# EAGLE design tedy (EAGLE 8.5.1)
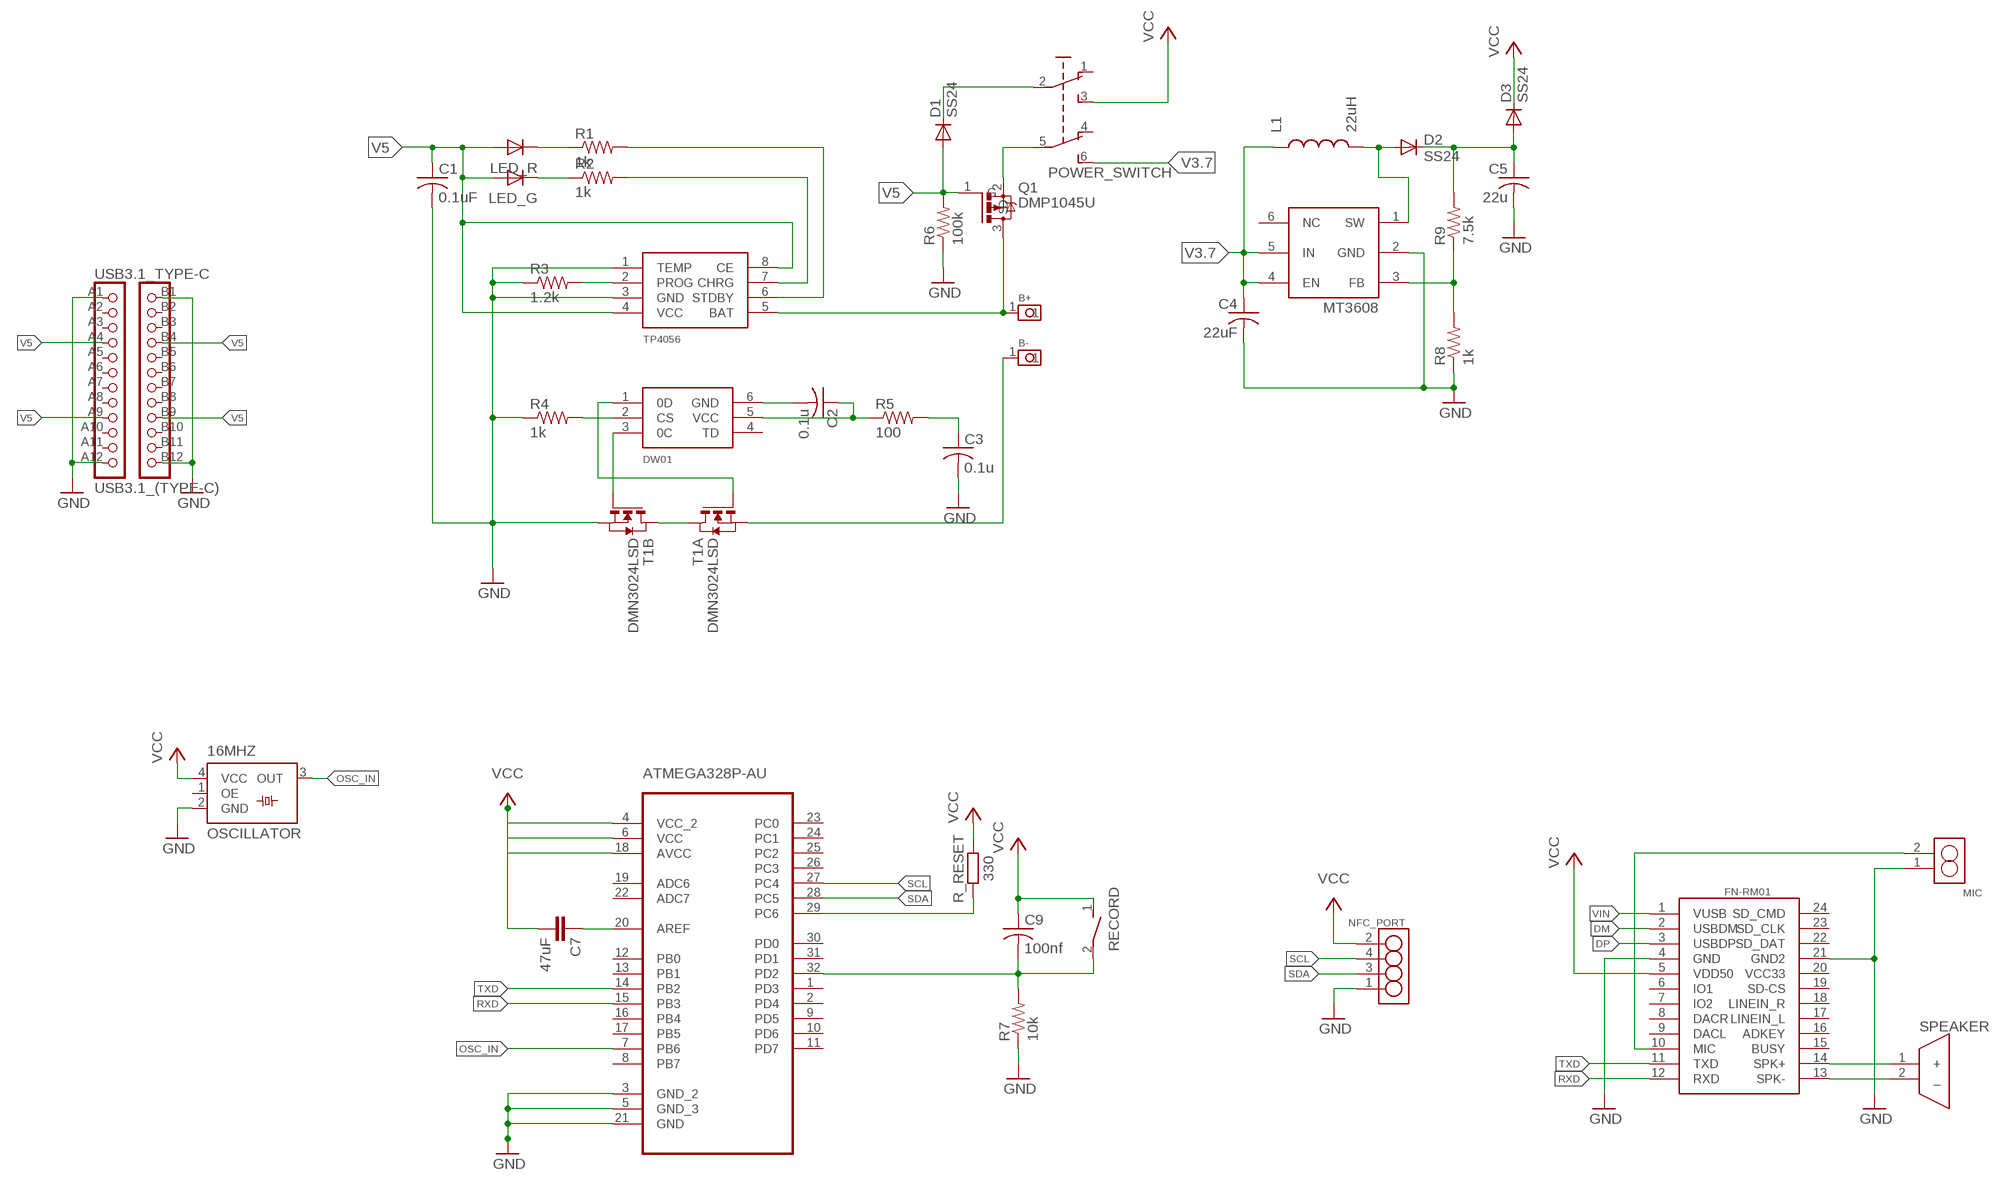
[diagram p0: schematic, sheet 1]

## Parts
16MHZ  OSCILLATOR  [OSCILLATOR_(3.2*2.5)]
ATMEGA328P-AU  ATMEGA328P-AU  [QFP80P900X900X120-32N]
B+  B+  PIN_1  [PIN_1]
B-  B-  PIN_1  [PIN_1]
C1  0.1uF  C-USC0805  [C0805]
C2  0.1u  C-USC0805  [C0805]
C3  0.1u  C-USC0805  [C0805]
C4  22uF  C-USC0805  [C0805]
C5  22u  C-USC0805  [C0805]
C7  47uF  C-EUC0805  [C0805]
C9  100nf  C-USC0805K  [C0805K]
D1  SS24  [SS24]
D2  SS24  [SS24]
D3  SS24  [SS24]
DW01  DW01  [SOT23-6]
FN-RM01  FN-RM01  [FN-RM01]
L1  22uH  4D28  [4D28]
LED_  2_COLOUR_LED  [2_COLOUR_LED]
MIC  CONNECTOR_1.5MM_THROUGH_HOLE_(2_PIN)  [CONNECTOR_1.5MM_THROUGH_HOLE_(2_PIN)]
MT3608  MT3608  [SOT23-6]
NFC_PORT  PN532  [PN532]
POWER_SWITCH  6PIN_SWITCH  [6PIN_SWITCH]
Q1  DMP1045U  [SOT23-3]
R1  1k  R-US_R0805  [R0805]
R2  1k  R-US_R0805  [R0805]
R3  1.2k  R-US_R0805  [R0805]
R4  1k  R-US_R0805  [R0805]
R5  100  R-US_R0805  [R0805]
R6  100k  R-US_R0805  [R0805]
R7  10k  R-US_R0805  [R0805]
R8  1k  R-US_R0805  [R0805]
R9  7.5k  R-US_R0805  [R0805]
R_RESET  330  R-EU_M0805  [M0805]
RECORD  PUSH_BUTTON(SIDE)  [PUSH_BUTTON(SIDE)]
SPEAKER  SPEAKER  [SPEAKER]
T1  DMN3024LSD  [TSSOP-8]
TP4056  TP4056  [SOP-8]
USB3.1_TYPE-C  USB3.1_(TYPE-C)  [USB3.1_(TYPE-C)]

## Nets
DM: FN-RM01.2(USBDM)
DP: FN-RM01.3(USBDP)
GND: 16MHZ.2(GND) ATMEGA328P-AU.3(GND_2) ATMEGA328P-AU.5(GND_3) ATMEGA328P-AU.21(GND) C1.2 C3.2 C4.2 C5.2 FN-RM01.4(GND) FN-RM01.21(GND2) MIC.1 MT3608.2(GND) NFC_PORT.1 R3.1 R4.1 R6.1 R7.1 R8.1 T1.6(B:S) T1.7(B:S) TP4056.1(TEMP) TP4056.3(GND) USB3.1_TYPE-C.A1 USB3.1_TYPE-C.A12 USB3.1_TYPE-C.B1 USB3.1_TYPE-C.B12
N$1: ATMEGA328P-AU.29(PC6) R_RESET.2
N$2: LED_.1 R1.1
N$3: LED_.3 R2.1
N$4: R3.2 TP4056.2(PROG)
N$5: R1.2 TP4056.6(STDBY)
N$6: DW01.2(CS) R4.2
N$7: R2.2 TP4056.7(CHRG)
N$8: DW01.1(0D) T1.4(A:G)
N$9: DW01.3(0C) T1.5(B:G)
N$10: T1.1(A:D) T1.8(B:D)
N$11: C2.2 DW01.6(GND)
N$12: C2.1 DW01.5(VCC) R5.1
N$13: B+.1 Q1.3(D) TP4056.5(BAT)
N$14: C3.1 R5.2
N$15: B-.1 T1.2(A:S) T1.3(A:S)
N$16: MT3608.3(FB) R8.2 R9.1
N$17: D1.2(C) POWER_SWITCH.2(P)
N$18: C5.1 D2.2(C) D3.1(A) R9.2
N$19: D2.1(A) L1.P$2 MT3608.1(SW)
N$21: ATMEGA328P-AU.20(AREF) C7.1
N$24: FN-RM01.14(SPK+) SPEAKER.1(+)
N$25: FN-RM01.13(SPK-) SPEAKER.2(_)
N$26: FN-RM01.10(MIC) MIC.2
N$29: ATMEGA328P-AU.32(PD2) C9.2 R7.2 RECORD.2
OSC_IN: 16MHZ.3(OUT) ATMEGA328P-AU.7(PB6)
RXD: ATMEGA328P-AU.15(PB3) FN-RM01.12(RXD)
SCL: ATMEGA328P-AU.27(PC4) NFC_PORT.4
SDA: ATMEGA328P-AU.28(PC5) NFC_PORT.3
TXD: ATMEGA328P-AU.14(PB2) FN-RM01.11(TXD)
V3.7: C4.1 L1.P$1 MT3608.4(EN) MT3608.5(IN) POWER_SWITCH.5(P1) POWER_SWITCH.6(S1) Q1.2(S)
V5: C1.1 D1.1(A) LED_.2 LED_.4 Q1.1(G) R6.2 TP4056.4(VCC) TP4056.8(CE) USB3.1_TYPE-C.A4 USB3.1_TYPE-C.A9 USB3.1_TYPE-C.B4 USB3.1_TYPE-C.B9
VCC: 16MHZ.4(VCC) ATMEGA328P-AU.4(VCC_2) ATMEGA328P-AU.6(VCC) ATMEGA328P-AU.18(AVCC) C7.2 C9.1 D3.2(C) FN-RM01.5(VDD50) NFC_PORT.2 POWER_SWITCH.3(S) R_RESET.1 RECORD.1
VIN: FN-RM01.1(VUSB)
Unconnected: 16MHZ.1(OE) ATMEGA328P-AU.1(PD3) ATMEGA328P-AU.2(PD4) ATMEGA328P-AU.8(PB7) ATMEGA328P-AU.9(PD5) ATMEGA328P-AU.10(PD6) ATMEGA328P-AU.11(PD7) ATMEGA328P-AU.12(PB0) ATMEGA328P-AU.13(PB1) ATMEGA328P-AU.16(PB4) ATMEGA328P-AU.17(PB5) ATMEGA328P-AU.19(ADC6) ATMEGA328P-AU.22(ADC7) ATMEGA328P-AU.23(PC0) ATMEGA328P-AU.24(PC1) ATMEGA328P-AU.25(PC2) ATMEGA328P-AU.26(PC3) ATMEGA328P-AU.30(PD0) ATMEGA328P-AU.31(PD1) DW01.4(TD) FN-RM01.6(IO1) FN-RM01.7(IO2) FN-RM01.8(DACR) FN-RM01.9(DACL) FN-RM01.15(BUSY) FN-RM01.16(ADKEY) FN-RM01.17(LINEIN_L) FN-RM01.18(LINEIN_R) FN-RM01.19(SD-CS) FN-RM01.20(VCC33) FN-RM01.22(SD_DAT) FN-RM01.23(SD_CLK) FN-RM01.24(SD_CMD) MT3608.6(NC) POWER_SWITCH.1(O) POWER_SWITCH.4(O1) USB3.1_TYPE-C.A2 USB3.1_TYPE-C.A3 USB3.1_TYPE-C.A5 USB3.1_TYPE-C.A6 USB3.1_TYPE-C.A7 USB3.1_TYPE-C.A8 USB3.1_TYPE-C.A10 USB3.1_TYPE-C.A11 USB3.1_TYPE-C.B2 USB3.1_TYPE-C.B3 USB3.1_TYPE-C.B5 USB3.1_TYPE-C.B6 USB3.1_TYPE-C.B7 USB3.1_TYPE-C.B8 USB3.1_TYPE-C.B10 USB3.1_TYPE-C.B11

## Library data of the parts
16MHZ = custom_package:OSCILLATOR
ATMEGA328P-AU = Atmel-ATMEGA328P-AU:ATMEGA328P-AU; DESCRIPTION: 8-bit Microcontroller with In-System Programmable Flash; MPN: ATMEGA328P-AU; OC_FARNELL: 1715486; OC_NEWARK: 14R4631; PACKAGE: TQFP-32; SUPPLIER: Atmel
B+ B- = custom_package:PIN_1
C1-C5 = resistor:C-US: CAPACITOR, American symbol
C7 = resistor:C-EU: CAPACITOR, European symbol
C9 = adafruit:C-US: CAPACITOR, American symbol
D1-D3 = custom_package:SS24
DW01 = DW01:DW01: The DW01-P battery protection IC is designed to protect lithium-ion/polymer battery from damage or degrading the lifetime due to overcharge, overdischarge, and/or overcurrent for one-cell lithium-ion/polymer battery powered systems, such as cellular phones. Data sheet <http://goo.gl/4y108d> Dave.Calaway Eagle Library <https://goo.gl/Muy1Tr>
FN-RM01 = custom_package:FN-RM01
L1 = custom_package:4D28
LED_ = custom_package:2_COLOUR_LED
MIC = custom_package:CONNECTOR_1.5MM_THROUGH_HOLE_(2_PIN); NAME123: name
MT3608 = custom_package:MT3608
NFC_PORT = custom_package:PN532
POWER_SWITCH = custom_package:6PIN_SWITCH
Q1 = custom_package:DMP1045U
R1-R6 R8 R9 = resistor:R-US_: RESISTOR, American symbol
R7 = adafruit:R-US_: RESISTOR, American symbol
R_RESET = resistor:R-EU_: RESISTOR, European symbol
RECORD = custom_package:PUSH_BUTTON(SIDE)
SPEAKER = custom_package:SPEAKER
T1 = FS8205A:DMN3024LSD: DUAL N-CHANNEL ENHANCEMENT MODE MOSFET data sheet <http://goo.gl/dRgboR> Dave.Calaway Eagle Library <https://goo.gl/Muy1Tr>
TP4056 = TP4056:TP4056
USB3.1_TYPE-C = custom_package:USB3.1_(TYPE-C)

## Board
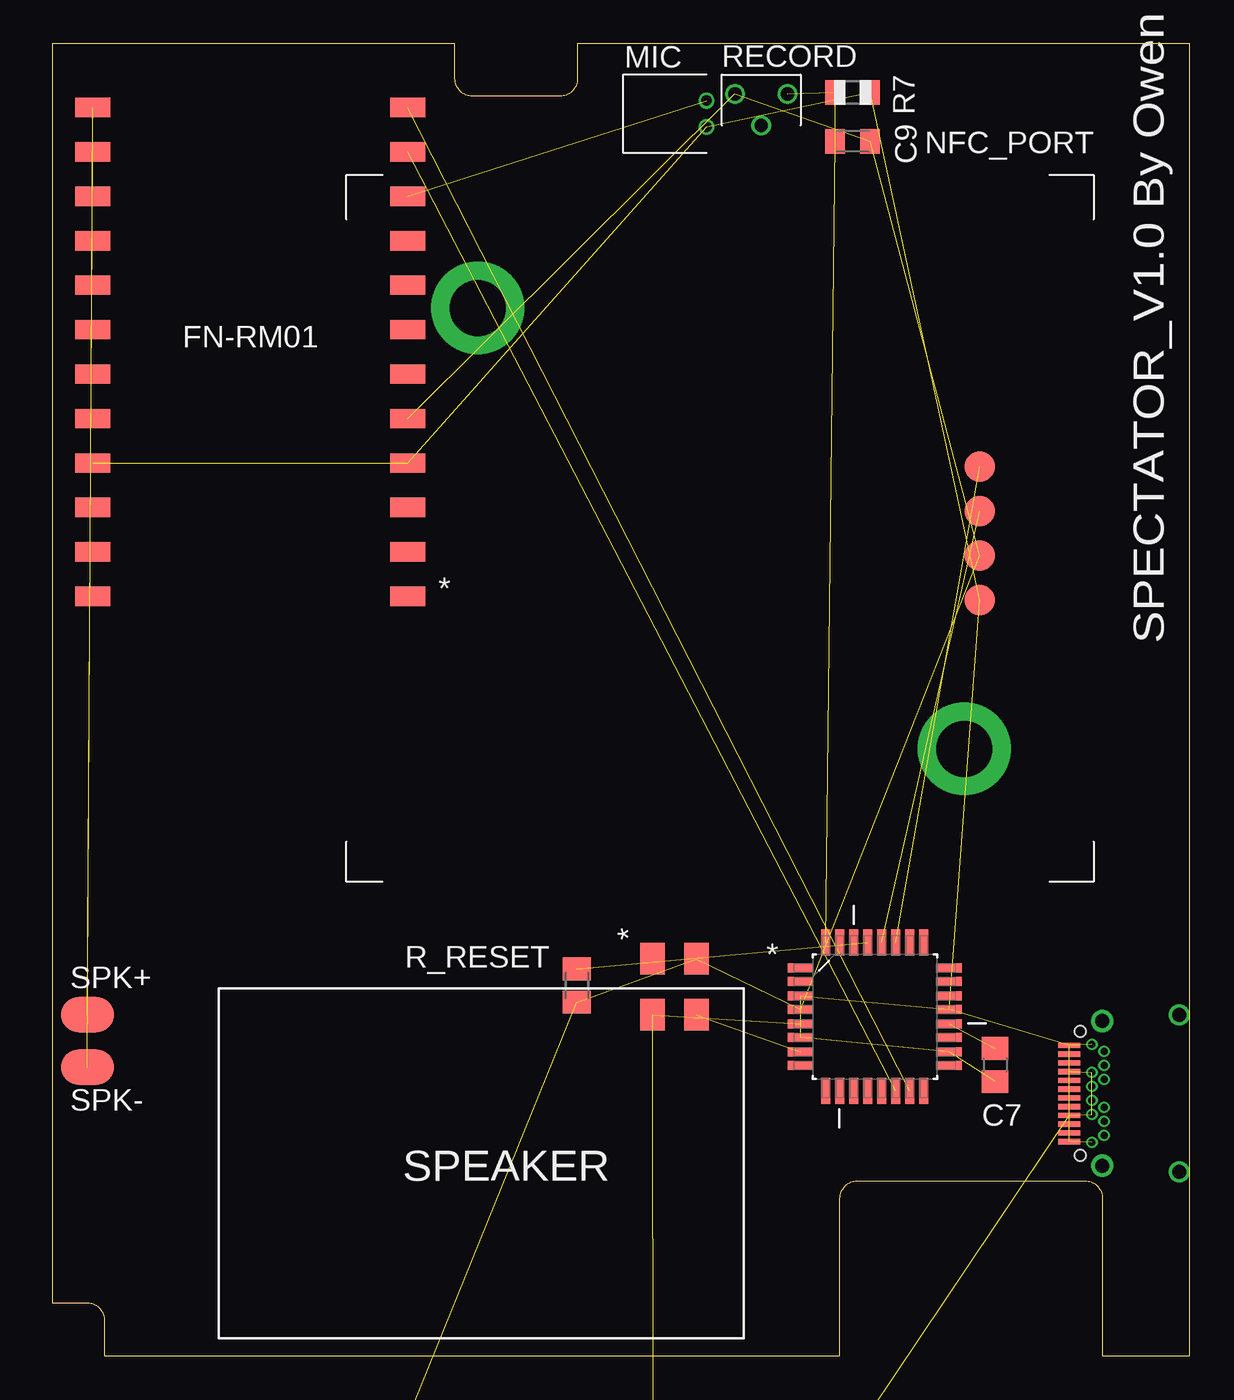
[diagram p1: board, top side]
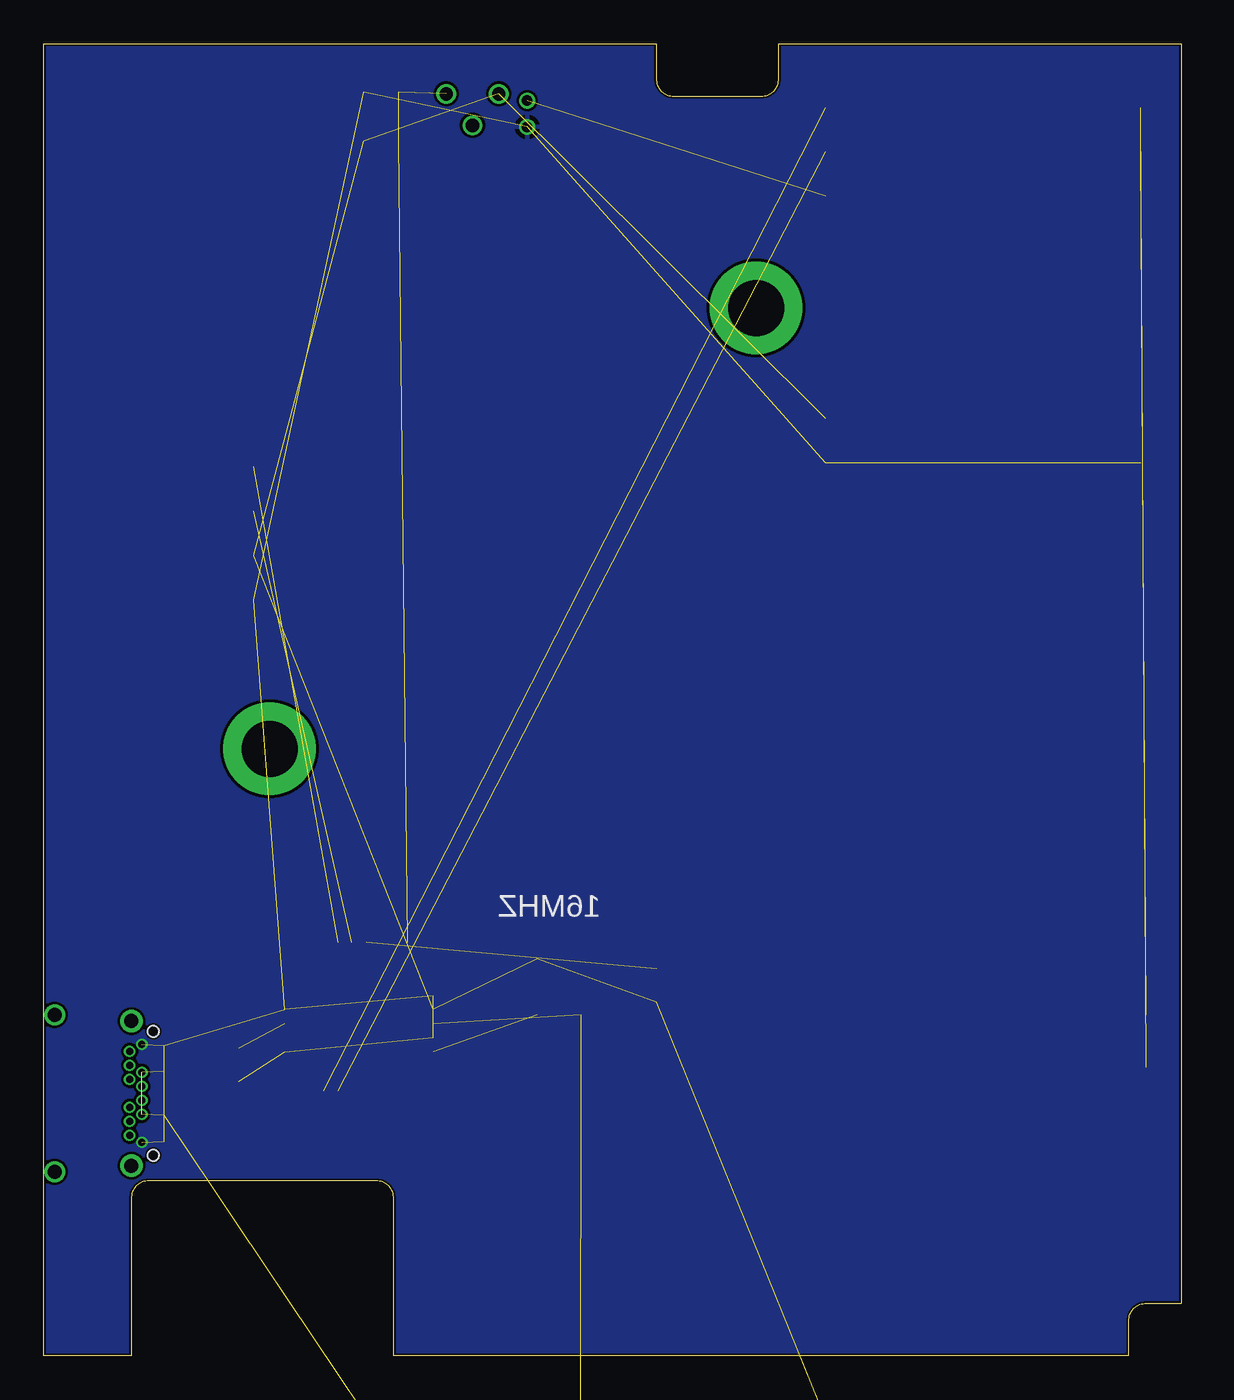
[diagram p2: board, bottom side, seen from below]

Size 65 x 75 mm. Coordinates in mm from the lower left corner, seen from the top.
Outline: 3,0 3,2 arc90 2,3 0,3 0,75 23,75 23,73 arc90 24,72 29,72 arc90 30,73 30,75 65,75 65,0 60,0 60,9 arc90 59,10 46,10 arc90 45,9 45,0 3,0
Copper layers (1*16): Top 0.035mm / dielectric 1.5mm / Bottom 0.035mm
Design rules "default *": minimum track width 6mil, minimum drill 0.35mm, track to track 6mil, track to pad 6mil, pad to pad 5mil, via to via 6mil, smd to smd 6mil, copper to edge 5mil, drill to drill 6mil, minimum pad ring 5mil, minimum via ring 8mil, stop-mask expansion 4mil, vias tented up to drill 0mil, thermal gap 10mil

### Footprints (pad centres in the part's own frame; a part is rotated, then mirrored left to right if it is on the bottom)
OSCILLATOR_(3.2*2.5) = smd 1.8 x 1.4: 1 0,0; 2 3.2,0; 3 3.2,2.5; 4 0,2.5
QFP80P900X900X120-32N = smd 1.473 x 0.508: 1 -4.242,2.794; 2 -4.242,2.007; 3 -4.242,1.194; 4 -4.242,0.406; 5 -4.242,-0.406; 6 -4.242,-1.194; 7 -4.242,-2.007; 8 -4.242,-2.794; 17 4.242,-2.794; 18 4.242,-2.007; 19 4.242,-1.194; 20 4.242,-0.406; 21 4.242,0.406; 22 4.242,1.194; 23 4.242,2.007; 24 4.242,2.794 | smd 0.508 x 1.473: 9 -2.794,-4.242; 10 -2.007,-4.242; 11 -1.194,-4.242; 12 -0.406,-4.242; 13 0.406,-4.242; 14 1.194,-4.242; 15 2.007,-4.242; 16 2.794,-4.242; 25 2.794,4.242; 26 2.007,4.242; 27 1.194,4.242; 28 0.406,4.242; 29 -0.406,4.242; 30 -1.194,4.242; 31 -2.007,4.242; 32 -2.794,4.242
PIN_1 = smd 3 x 2: 1 0,0
C0805 = smd 1.3 x 1.5: 1 -0.95,0; 2 0.95,0
C0805K = smd 1.1 x 1.4: 1 -1,0; 2 1,0
SS24 = smd 2.159 x 2.743: 1 -2.21,0; 2 2.21,0
SOT23-6 = smd 0.4 x 0.6: 1 -0.95,-1.1; 2 0,-1.1; 3 0.95,-1.1; 4 0.95,1.1; 5 0,1.1; 6 -0.95,1.1
FN-RM01 = smd 2 x 1.1: 1 -9,12.535; 2 -9,9.995; 3 -9,7.455; 4 -9,4.915; 5 -9,2.375; 6 -9,-0.165; 7 -9,-2.705; 8 -9,-5.245; 9 -9,-7.785; 10 -9,-10.325; 11 -9,-12.865; 12 -9,-15.405; 13 9,-15.405; 14 9,-12.865; 15 9,-10.325; 16 9,-7.785; 17 9,-5.245; 18 9,-2.705; 19 9,-0.165; 20 9,2.375; 21 9,4.915; 22 9,7.455; 23 9,9.995; 24 9,12.535
4D28 = smd 5.3 x 1.9: P$1 0,1.65; P$2 0,-1.65
2_COLOUR_LED = smd 0.8 x 0.65: 1 -0.75,0.425; 2 0.75,0.425; 3 -0.75,-0.425; 4 0.75,-0.425
CONNECTOR_1.5MM_THROUGH_HOLE_(2_PIN) = drill 0.6: 1 -0.75,-2.375; 2 0.75,-2.375
PN532 = smd 1.75 x 1.75: 1 6.5,24.295; 2 6.5,21.755; 3 6.5,19.215; 4 6.5,16.675 | drill 3.2 pad 5.3: P$5 7.4,32.8; P$6 35.2,7.6
6PIN_SWITCH = drill 0.35 long: 1 -2,-1.25; 2 0,-1.25; 3 2,-1.25; 4 -2,1.25; 5 0,1.25; 6 2,1.25 | drill 1.5: P$7 5.2,0; P$8 -5.2,0
SOT23-3 = smd 1 x 1.4: 1 -0.95,-1.1; 2 0.95,-1.1; 3 0,1.1
R0805 = smd 1.3 x 1.5: 1 -0.95,0; 2 0.95,0
R0805' = smd 1.1 x 1.4: 1 -1,0; 2 1,0
M0805 = smd 1.3 x 1.6: 1 -0.95,0; 2 0.95,0
PUSH_BUTTON(SIDE) = drill 0.75: 1 -1.5,0.35; 2 1.5,0.35; P$1 0,-1.45
SPEAKER = smd 3 x 2: 1 0,1.5; 2 0,-1.5
TSSOP-8 = smd 0.3 x 0.75: 1 -0.975,-2.925; 2 -0.325,-2.925; 3 0.325,-2.925; 4 0.975,-2.925; 5 0.975,2.925; 6 0.325,2.925; 7 -0.325,2.925; 8 -0.975,2.925
SOP-8 = smd 1.3 x 0.7: 1 -2.75,1.905; 2 -2.75,0.635; 3 -2.75,-0.635; 4 -2.75,-1.905; 5 2.75,-1.905; 6 2.75,-0.635; 7 2.75,0.635; 8 2.75,1.905
USB3.1_(TYPE-C) = smd 0.3 x 1.27: A1 -2.75,3.9; A2 -2.25,3.9; A3 -1.75,3.9; A4 -1.25,3.9; A5 -0.75,3.9; A6 -0.25,3.9; A7 0.25,3.9; A8 0.75,3.9; A9 1.25,3.9; A10 1.75,3.9; A11 2.25,3.9; A12 2.75,3.9 | drill 0.4 pad 0.65: B1 2.8,2.61; B2 2.4,1.91; B3 1.6,1.91; B4 1.2,2.61; B5 0.8,1.91; B6 0.4,2.61; B7 -0.4,2.61; B8 -0.8,1.91; B9 -1.2,2.61; B10 -1.6,1.91; B11 -2.4,1.91; B12 -2.8,2.61 | drill 0.8 pad 1.27: P$13 4.13,2.01; P$14 -4.13,2.01 | drill 0.8: P$15 4.49,-2.38; P$16 -4.49,-2.38 | hole 0.65: -3.54,3.26; 3.54,3.26

### Placement (x,y rotation side)
16MHZ  34.29,22.69 270 top
ATMEGA328P-AU  46.99,19.38 0 top
B+  14,-52 0 top  (outside the outline)
B-  24,-52 0 top  (outside the outline)
C1  25,-37 0 top  (outside the outline)
C2  9,-45 0 top  (outside the outline)
C3  14,-45 0 top  (outside the outline)
C4  -1,-45 0 top  (outside the outline)
C5  19,-45 0 top  (outside the outline)
C7  53.86,16.62 270 top
C9  45.72,69.42 180 top
D1  2,-29 0 top  (outside the outline)
D2  10,-29 0 top  (outside the outline)
D3  18,-29 0 top  (outside the outline)
DW01  0,-52 0 top  (outside the outline)
FN-RM01  11.31,55.95 180 top
L1  31,-30 0 top  (outside the outline)
LED_  32,-50 0 top  (outside the outline)
MIC  35,71 90 top
MT3608  5,-52 0 top  (outside the outline)
NFC_PORT  59.5,67.5 180 top
POWER_SWITCH  14,-13 0 top  (outside the outline)
Q1  0,-38 0 top  (outside the outline)
R1  23,-45 0 top  (outside the outline)
R2  27,-45 0 top  (outside the outline)
R3  31,-37 0 top  (outside the outline)
R4  31,-45 0 top  (outside the outline)
R5  4,-45 0 top  (outside the outline)
R6  19,-37 0 top  (outside the outline)
R7  10k  [R0805']  45.72,72.22 180 top
R8  35,-45 0 top  (outside the outline)
R9  36,-37 0 top  (outside the outline)
R_RESET  29.97,21.16 90 top
RECORD  40.5,71.78 0 top
SPEAKER  2,18 0 top
T1  34,-9 0 top  (outside the outline)
TP4056  12,-38 0 top  (outside the outline)
USB3.1_TYPE-C  62,15 90 top

### Tracks (layer width: path | path; a pad name or v marks a point on that pad's centre or on a via)
GND  (25 unrouted)
  pour Bottom: -1,0 -1,76 66,76 66,-1 -1,-1
N$1  (1 unrouted)
N$2  (1 unrouted)
N$3  (1 unrouted)
N$4  (1 unrouted)
N$5  (1 unrouted)
N$6  (1 unrouted)
N$7  (1 unrouted)
N$8  (1 unrouted)
N$9  (1 unrouted)
N$10  (1 unrouted)
N$11  (1 unrouted)
N$12  (2 unrouted)
N$13  (2 unrouted)
N$14  (1 unrouted)
N$15  (2 unrouted)
N$16  (2 unrouted)
N$17  (1 unrouted)
N$18  (3 unrouted)
N$19  (2 unrouted)
N$21  (1 unrouted)
N$24  (1 unrouted)
N$25  (1 unrouted)
N$26  (1 unrouted)
N$29  (3 unrouted)
OSC_IN  (1 unrouted)
RXD  (1 unrouted)
SCL  (1 unrouted)
SDA  (1 unrouted)
TXD  (1 unrouted)
V3.7  (6 unrouted)
V5  (11 unrouted)
VCC  (11 unrouted)

### Text on the board
tPlace: SPEAKER
tNames: SPECTATOR_V1.0 By Owen